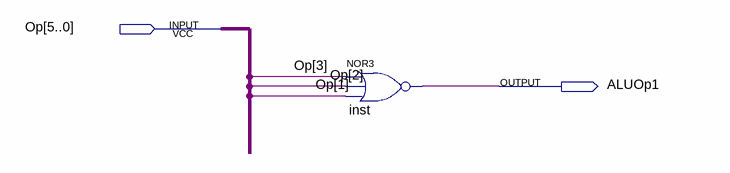
[diagram p0: schematic sheet]
// Quartus schematic ALUOp1Decoder.bdf as structural Verilog: 1 symbols, 2 pins
module ALUOp1Decoder (
  input  [5:0] Op,
  output ALUOp1
);

  nor inst (ALUOp1, Op[3], Op[2], Op[1]);
endmodule
